# Altium schematic sheet AMC_FMC_Carrier.SchDoc
size A4; DocumentNumber: 2; SheetNumber: 2; SheetTotal: 30
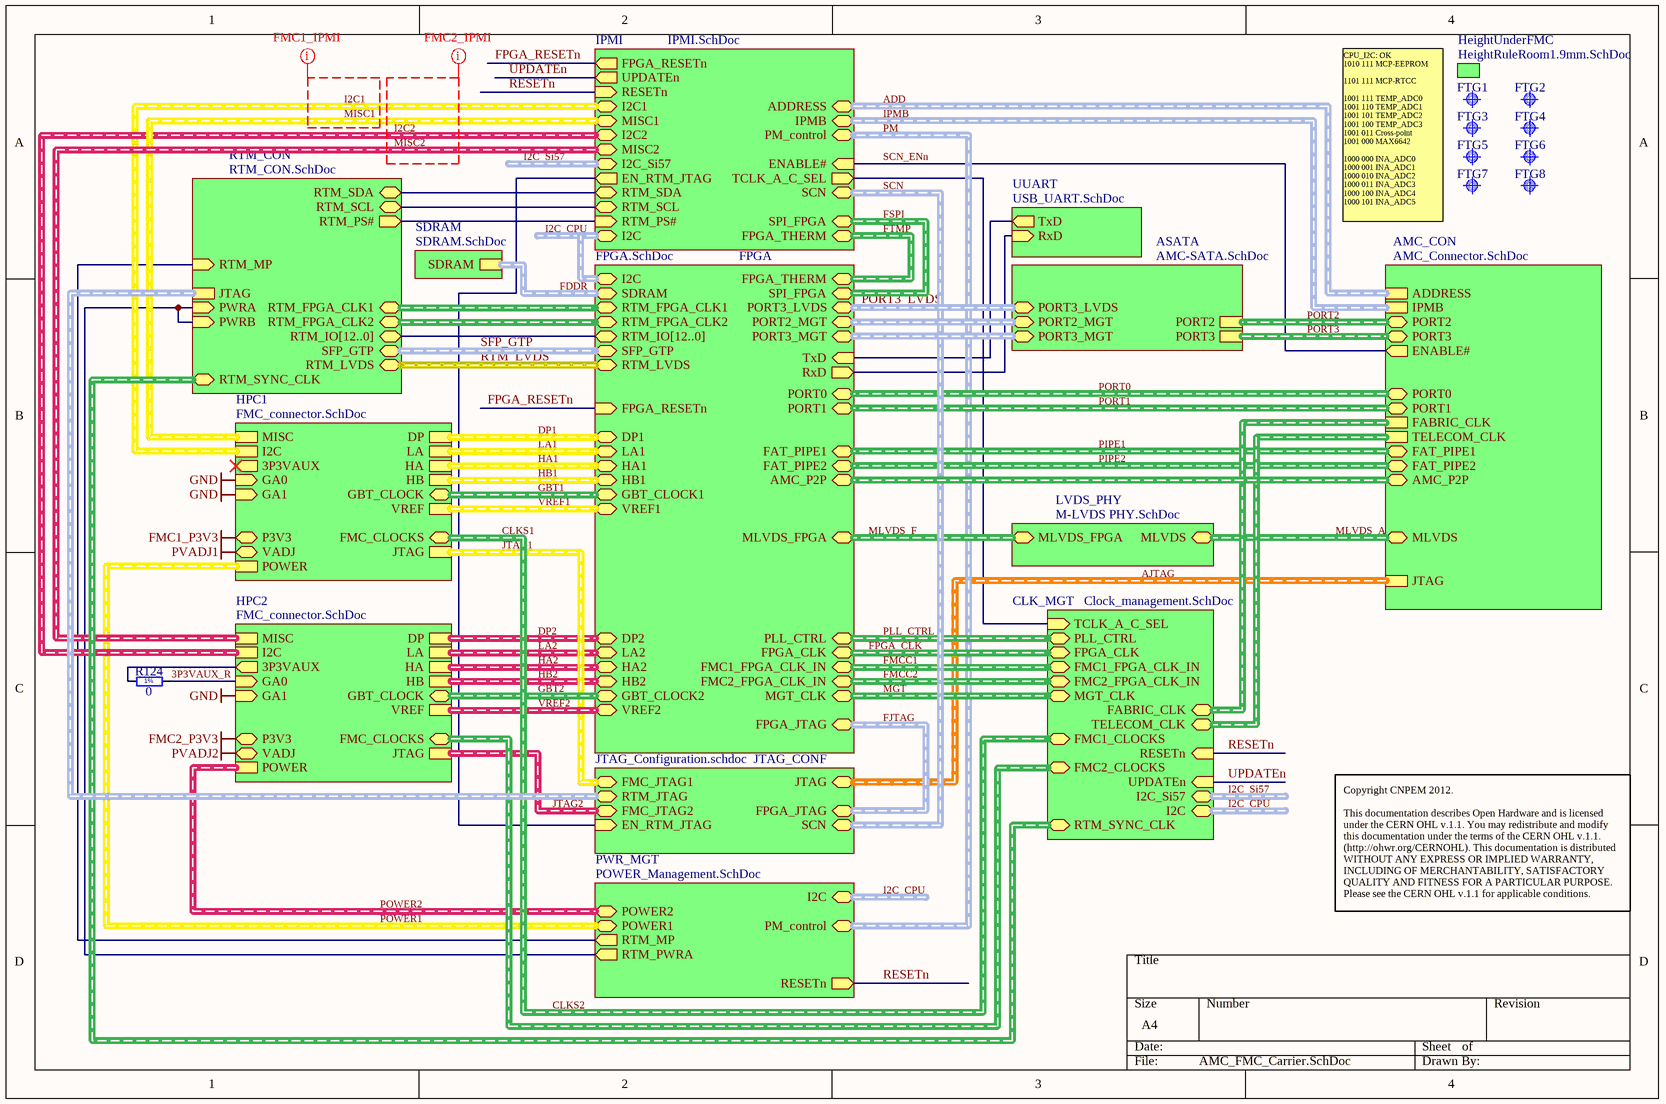
[diagram p0: AMC_FMC_Carrier.SchDoc]

## Parts
FTG1  Use only in PCB  [FIDUCIAL_TOP_S100-200]  (value not drawn)
FTG2  Use only in PCB  [FIDUCIAL_TOP_C100-200]  (value not drawn)
FTG3  Use only in PCB  [FIDUCIAL_TOP_S100-200]  (value not drawn)
FTG4  Use only in PCB  [FIDUCIAL_TOP_C100-200]  (value not drawn)
FTG5  Use only in PCB  [FIDUCIAL_TOP_S100-200]  (value not drawn)
FTG6  Use only in PCB  [FIDUCIAL_TOP_C100-200]  (value not drawn)
FTG7  Use only in PCB  [FIDUCIAL_TOP_S100-200]  (value not drawn)
FTG8  Use only in PCB  [FIDUCIAL_TOP_C100-200]  (value not drawn)
R124  0  [RESC1005X40N]

## Sub-sheets
AMC_CON = AMC_Connector.SchDoc: JTAG (harness AMC_JTAG), TELECOM_CLK (harness AMC_TELECOM_CLOCK), ADDRESS (harness AMC_ADD), FABRIC_CLK (harness AMC_FABRIC_CLOCK), IPMB (harness I2C), ENABLE# (out), PORT0 (harness PORT0), PORT1 (harness PORT1), PORT2 (harness PORT2), PORT3 (harness PORT3), FAT_PIPE1 (harness FAT_PIPE1), FAT_PIPE2 (harness FAT_PIPE2), MLVDS (harness MLVDS), AMC_P2P (harness AMC_P2P)
ASATA = AMC-SATA.SchDoc: PORT2 (harness PORT2), PORT3 (harness PORT3), PORT2_MGT (harness PORT2), PORT3_MGT (harness PORT3), PORT3_LVDS (harness PORT3)
CLK_MGT = Clock_management.SchDoc: FABRIC_CLK (harness AMC_FABRIC_CLOCK), TELECOM_CLK (harness AMC_TELECOM_CLOCK), FMC1_CLOCKS (harness FMC_CLOCKS), FMC2_CLOCKS (harness FMC_CLOCKS), MGT_CLK (harness MGT_CLK), FMC1_FPGA_CLK_IN (harness FMC_FPGA_CLK_IN), FMC2_FPGA_CLK_IN (harness FMC_FPGA_CLK_IN), FPGA_CLK (harness FPGA_SDRAM_CLK), PLL_CTRL (harness PLL_CTRL), RESETn (in), UPDATEn (in), I2C (harness I2C), RTM_SYNC_CLK (harness CLK_DIFF), TCLK_A_C_SEL (in), I2C_Si57 (harness I2C)
FPGA = FPGA.SchDoc: SDRAM (harness DDR), FPGA_JTAG (harness FMC_J1_JTAG), VREF2 (harness FMC_J1_VREF), VREF1 (harness FMC_J1_VREF), FPGA_THERM (harness FPGA_THERM), SPI_FPGA (harness SPI), FAT_PIPE1, FAT_PIPE2, PORT1, PORT0, MLVDS_FPGA, GBT_CLOCK1, GBT_CLOCK2, MGT_CLK, FMC1_FPGA_CLK_IN, FMC2_FPGA_CLK_IN, FPGA_CLK, PLL_CTRL (harness PLL_CTRL), FPGA_RESETn (in), I2C (harness I2C), LA1, HA1, HB1, LA2, HA2, HB2, DP1, DP2, PORT2_MGT (harness PORT2), PORT3_MGT (harness PORT3), RxD (out), TxD (in), RTM_IO[12..0] (bidir), RTM_LVDS (harness RTM_LVDS), SFP_GTP (harness SFP_GTP), RTM_FPGA_CLK1 (harness CLK_DIFF), RTM_FPGA_CLK2 (harness CLK_DIFF), PORT3_LVDS (harness PORT3), AMC_P2P (harness AMC_P2P)
HeightUnderFMC = HeightRuleRoom1.9mm.SchDoc: no entries
HPC1 = FMC_connector.SchDoc: DP (harness FMC_J1_DP), LA (harness FMC_J1_LA), HA (harness FMC_J1_HA), HB (harness FMC_J1_HB), MISC (harness MISC), POWER (harness FMC_J1_POWER), JTAG (harness FMC_J1_JTAG), I2C (harness I2C), GA0 (in), GA1 (in), 3P3VAUX (out), VREF (harness FMC_J1_VREF), FMC_CLOCKS (harness FMC_CLOCKS), GBT_CLOCK (harness GBT_CLOCK), VADJ, P3V3
HPC2 = FMC_connector.SchDoc: DP (harness FMC_J1_DP), LA (harness FMC_J1_LA), HA (harness FMC_J1_HA), HB (harness FMC_J1_HB), MISC (harness MISC), POWER (harness FMC_J1_POWER), JTAG (harness FMC_J1_JTAG), I2C (harness I2C), VREF (harness FMC_J1_VREF), GA0 (in), GA1 (in), 3P3VAUX (out), FMC_CLOCKS (harness FMC_CLOCKS), GBT_CLOCK (harness GBT_CLOCK), VADJ, P3V3
IPMI = IPMI.SchDoc: I2C1 (harness I2C), I2C2 (harness I2C), IPMB (harness I2C), ADDRESS (harness AMC_ADD), MISC1 (harness MISC), MISC2 (harness MISC), PM_control (harness pm_control), FPGA_THERM (harness FPGA_THERM), SPI_FPGA (harness SPI), ENABLE# (in), UPDATEn (out), RESETn (in), I2C (harness I2C), SCN (harness SCN), FPGA_RESETn (out), RTM_SDA (bidir), RTM_SCL (bidir), RTM_PS# (in), EN_RTM_JTAG (out), TCLK_A_C_SEL (out), I2C_Si57 (harness I2C)
JTAG_CONF = JTAG_Configuration.schdoc: FMC_JTAG1 (harness FMC_J1_JTAG), FMC_JTAG2 (harness FMC_J1_JTAG), JTAG (harness AMC_JTAG), FPGA_JTAG (harness FMC_J1_JTAG), SCN (harness SCN), RTM_JTAG (harness RTM_JTAG), EN_RTM_JTAG (in)
LVDS_PHY = M-LVDS PHY.SchDoc: MLVDS (harness MLVDS), MLVDS_FPGA (harness MLVDS-FPGA)
PWR_MGT = POWER_Management.SchDoc: POWER1 (harness FMC_J1_POWER), POWER2 (harness FMC_J1_POWER), PM_control (harness PM_control), RESETn (out), I2C (harness I2C), RTM_MP (out), RTM_PWRA (out)
RTM_CON = RTM_CON.SchDoc: RTM_IO[12..0] (bidir, harness JTAG), RTM_LVDS (harness RTM_LVDS), PWRA (in), PWRB (in), RTM_PS# (out), RTM_SDA (bidir), RTM_SCL (bidir), RTM_MP (in), RTM_SYNC_CLK (harness CLK_DIFF), SFP_GTP (harness SFP_GTP), JTAG (harness FMC_J1_JTAG), RTM_FPGA_CLK1 (harness CLK_DIFF), RTM_FPGA_CLK2 (harness CLK_DIFF)
SDRAM = SDRAM.SchDoc: SDRAM (harness DDR)
UUART = USB_UART.SchDoc: TxD (out), RxD (in)

## Nets
FMC1_P3V3: sheet HPC1/P3V3
FMC2_P3V3: sheet HPC2/P3V3
GND: sheet HPC1/GA0, sheet HPC1/GA1, sheet HPC2/GA1
PVADJ1: sheet HPC1/VADJ
PVADJ2: sheet HPC2/VADJ
3P3VAUX_R: R124.2 ; sheet HPC2/GA0
FPGA_RESETn: sheet FPGA/FPGA_RESETn, sheet IPMI/FPGA_RESETn
RESETn: sheet PWR_MGT/RESETn, sheet IPMI/RESETn, sheet CLK_MGT/RESETn
SCN_ENn: sheet AMC_CON/ENABLE#, sheet IPMI/ENABLE#
UPDATEn: sheet IPMI/UPDATEn, sheet CLK_MGT/UPDATEn
NetR124_1: R124.1 ; sheet HPC2/3P3VAUX
(unnamed): sheet FPGA/RxD, sheet UUART/RxD
(unnamed): sheet FPGA/TxD, sheet UUART/TxD
(unnamed): sheet PWR_MGT/RTM_MP, sheet RTM_CON/RTM_MP
(unnamed): sheet PWR_MGT/RTM_PWRA, sheet RTM_CON/PWRA, sheet RTM_CON/PWRB
(unnamed): sheet IPMI/RTM_SDA, sheet RTM_CON/RTM_SDA
(unnamed): sheet IPMI/RTM_SCL, sheet RTM_CON/RTM_SCL
(unnamed): sheet IPMI/RTM_PS#, sheet RTM_CON/RTM_PS#
(unnamed): sheet IPMI/EN_RTM_JTAG, sheet JTAG_CONF/EN_RTM_JTAG
(unnamed): sheet IPMI/TCLK_A_C_SEL, sheet CLK_MGT/TCLK_A_C_SEL

## Buses and harness runs
harness ADD = sheet AMC_CON/ADDRESS = sheet IPMI/ADDRESS
harness AJTAG = sheet AMC_CON/JTAG = sheet JTAG_CONF/JTAG
harness CLKS1 = CLKS2 = sheet CLK_MGT/FMC1_CLOCKS = sheet HPC1/FMC_CLOCKS
harness DP1 = sheet FPGA/DP1 = sheet HPC1/DP
harness DP2 = sheet FPGA/DP2 = sheet HPC2/DP
harness FDDR = sheet FPGA/SDRAM = sheet SDRAM/SDRAM
harness FJTAG = sheet FPGA/FPGA_JTAG = sheet JTAG_CONF/FPGA_JTAG
harness FMCC1 = sheet CLK_MGT/FMC1_FPGA_CLK_IN = sheet FPGA/FMC1_FPGA_CLK_IN
harness FMCC2 = sheet CLK_MGT/FMC2_FPGA_CLK_IN = sheet FPGA/FMC2_FPGA_CLK_IN
harness FPGA_CLK = sheet CLK_MGT/FPGA_CLK = sheet FPGA/FPGA_CLK
harness FSPI = sheet FPGA/SPI_FPGA = sheet IPMI/SPI_FPGA
harness FTMP = sheet FPGA/FPGA_THERM = sheet IPMI/FPGA_THERM
harness GBT1 = sheet FPGA/GBT_CLOCK1 = sheet HPC1/GBT_CLOCK
harness GBT2 = sheet FPGA/GBT_CLOCK2 = sheet HPC2/GBT_CLOCK
harness HA1 = sheet FPGA/HA1 = sheet HPC1/HA
harness HA2 = sheet FPGA/HA2 = sheet HPC2/HA
harness HB1 = sheet FPGA/HB1 = sheet HPC1/HB
harness HB2 = sheet FPGA/HB2 = sheet HPC2/HB
harness I2C1 = sheet HPC1/I2C = sheet IPMI/I2C1
harness I2C2 = sheet HPC2/I2C = sheet IPMI/I2C2
harness I2C_CPU = sheet CLK_MGT/I2C
harness I2C_CPU = sheet FPGA/I2C = sheet IPMI/I2C
harness I2C_CPU = sheet PWR_MGT/I2C
harness I2C_Si57 = sheet CLK_MGT/I2C_Si57
harness I2C_Si57 = sheet IPMI/I2C_Si57
harness IPMB = sheet AMC_CON/IPMB = sheet IPMI/IPMB
harness JTAG1 = sheet HPC1/JTAG = sheet JTAG_CONF/FMC_JTAG1
harness JTAG2 = sheet HPC2/JTAG = sheet JTAG_CONF/FMC_JTAG2
harness LA1 = sheet FPGA/LA1 = sheet HPC1/LA
harness LA2 = sheet FPGA/LA2 = sheet HPC2/LA
harness MGT = sheet CLK_MGT/MGT_CLK = sheet FPGA/MGT_CLK
harness MISC1 = sheet HPC1/MISC = sheet IPMI/MISC1
harness MISC2 = sheet HPC2/MISC = sheet IPMI/MISC2
harness MLVDS_A = sheet AMC_CON/MLVDS = sheet LVDS_PHY/MLVDS
harness MLVDS_F = sheet FPGA/MLVDS_FPGA = sheet LVDS_PHY/MLVDS_FPGA
harness PIPE1 = sheet AMC_CON/FAT_PIPE1 = sheet FPGA/FAT_PIPE1
harness PIPE2 = sheet AMC_CON/FAT_PIPE2 = sheet FPGA/FAT_PIPE2
harness PLL_CTRL = sheet CLK_MGT/PLL_CTRL = sheet FPGA/PLL_CTRL
harness PM = sheet IPMI/PM_control = sheet PWR_MGT/PM_control
harness PORT0 = sheet AMC_CON/PORT0 = sheet FPGA/PORT0
harness PORT1 = sheet AMC_CON/PORT1 = sheet FPGA/PORT1
harness PORT2 = sheet AMC_CON/PORT2 = sheet ASATA/PORT2
harness PORT3 = sheet AMC_CON/PORT3 = sheet ASATA/PORT3
harness PORT3_LVDS = sheet ASATA/PORT3_LVDS = sheet FPGA/PORT3_LVDS
harness POWER1 = sheet HPC1/POWER = sheet PWR_MGT/POWER1
harness POWER2 = sheet HPC2/POWER = sheet PWR_MGT/POWER2
harness RTM_LVDS = sheet FPGA/RTM_LVDS = sheet RTM_CON/RTM_LVDS
harness SCN = sheet IPMI/SCN = sheet JTAG_CONF/SCN
harness SFP_GTP = sheet FPGA/SFP_GTP = sheet RTM_CON/SFP_GTP
harness sheet AMC_CON/AMC_P2P = sheet FPGA/AMC_P2P
harness sheet AMC_CON/FABRIC_CLK = sheet CLK_MGT/FABRIC_CLK
harness sheet AMC_CON/TELECOM_CLK = sheet CLK_MGT/TELECOM_CLK
harness sheet ASATA/PORT2_MGT = sheet FPGA/PORT2_MGT
harness sheet ASATA/PORT3_MGT = sheet FPGA/PORT3_MGT
harness sheet CLK_MGT/FMC2_CLOCKS = sheet HPC2/FMC_CLOCKS
harness sheet CLK_MGT/RTM_SYNC_CLK = sheet RTM_CON/RTM_SYNC_CLK
harness sheet FPGA/RTM_FPGA_CLK1 = sheet RTM_CON/RTM_FPGA_CLK1
harness sheet FPGA/RTM_FPGA_CLK2 = sheet RTM_CON/RTM_FPGA_CLK2
harness sheet JTAG_CONF/RTM_JTAG = sheet RTM_CON/JTAG
harness VREF1 = sheet FPGA/VREF1 = sheet HPC1/VREF
harness VREF2 = sheet FPGA/VREF2 = sheet HPC2/VREF

## Layout directives
net class FMC1_IPMI: I2C1, MISC1
net class FMC2_IPMI: I2C2, MISC2

## Notes on the sheet
- CPU_I2C: OK
  1010 111 MCP-EEPROM
  1101 111 MCP-RTCC
  1001 111 TEMP_ADC0
  1001 110 TEMP_ADC1
  1001 101 TEMP_ADC2
  1001 100 TEMP_ADC3
  1001 011 Cross-point
  1001 000 MAX6642
  1000 000 INA_ADC0
  1000 001 INA_ADC1
  1000 010 INA_ADC2
  1000 011 INA_ADC3
  1000 100 INA_ADC4
  1000 101 INA_ADC5
- Copyright CNPEM 2012.
  This documentation describes Open Hardware and is licensed under the CERN OHL v.1.1. You may redistribute and modify this documentation under the terms of the CERN OHL v.1.1. (http://ohwr.org/CERNOHL). This documentation is distributed WITHOUT ANY EXPRESS OR IMPLIED WARRANTY, INCLUDING OF MERCHANTABILITY, SATISFACTORY QUALITY AND FITNESS FOR A PARTICULAR PURPOSE. Please see the CERN OHL v.1.1 for applicable conditions.
- (in symbol R0402_0R_JUMPER) 1%

## Library data of the parts
FTG1 FTG3 FTG5 FTG7 = FIDUCIAL_TARGET_S100-200: Fiducial Target; Part Description: Square Fiducial Target, Top Layer, 1.0mm, Top Solder 2.0mm, Keepout =2.0mm; Mounted: No; Table: Pads; Part Number: FIDUCIAL_TARGET_S100-200; Component Kind: Standard (No BOM); Component Type: Standard (No BOM); Pin Count: 1; Family: Fiducial; Socket: No; SMD: Yes; Status: None; ComponentHeight: 0mm; Author: CERN DEM JLC; CreateDate: 2010-02-09; LatestRevisionDate: 2012-04-04; PackageDescription: Square Fiducial Target, Top Layer, 1.0mm, Top Solder 2.0mm, Keepout =2.0mm
FTG2 FTG4 FTG6 FTG8 = FIDUCIAL_TARGET_C100-200: Fiducial Target; Part Description: Round Fiducial Target, Top Layer, 1.0mm, Top Solder 2.0mm, Keepout =2.0mm; Mounted: No; Table: Pads; Part Number: FIDUCIAL_TARGET_C100-200; Component Kind: Standard (No BOM); Component Type: Standard (No BOM); Pin Count: 1; Family: Fiducial; Socket: No; SMD: Yes; Status: None; ComponentHeight: 0mm; Author: CERN DEM JLC; CreateDate: 2010-02-09; LatestRevisionDate: 2012-04-04; PackageDescription: Round Fiducial Target, Top Layer, 1.0mm, Top Solder 2.0mm, Keepout =2.0mm
R124 = R0402_0R_JUMPER: Resistor - 1%; Part Description: 1A (0.05R Max DC Resistance) Zero Ohm Jumper; Manufacturer: GENERIC; Manufacturer1 Part Number: 232270591001L; Table: Resistors SMD; Part Number: R0402_0R_JUMPER; Component Kind: Standard; Component Type: Standard; Pin Count: 2; Value: 0; Status: Not recommended; Manufacturer Part Number: R0402_0R_JUMPER; Case: 0402; Mounted: Yes; Socket: No; SMD: Yes; Manufacturer1 Example: YAGEO PHYCOMP; Manufacturer1 ComponentHeight: 0.4mm; HelpURL: \\cern.ch\dfs\Applications\Altium\Datasheets\R0402_Phycomp_RC0402.pdf; Author: CERN DEM JLC; CreateDate: 2007-12-03; LatestRevisionDate: 2012-10-17